# Altium schematic sheet driver2.SchDoc: Oncilla motor control board
size A4; DocumentNumber: 2; Revision: 3; SheetNumber: 2; SheetTotal: 5
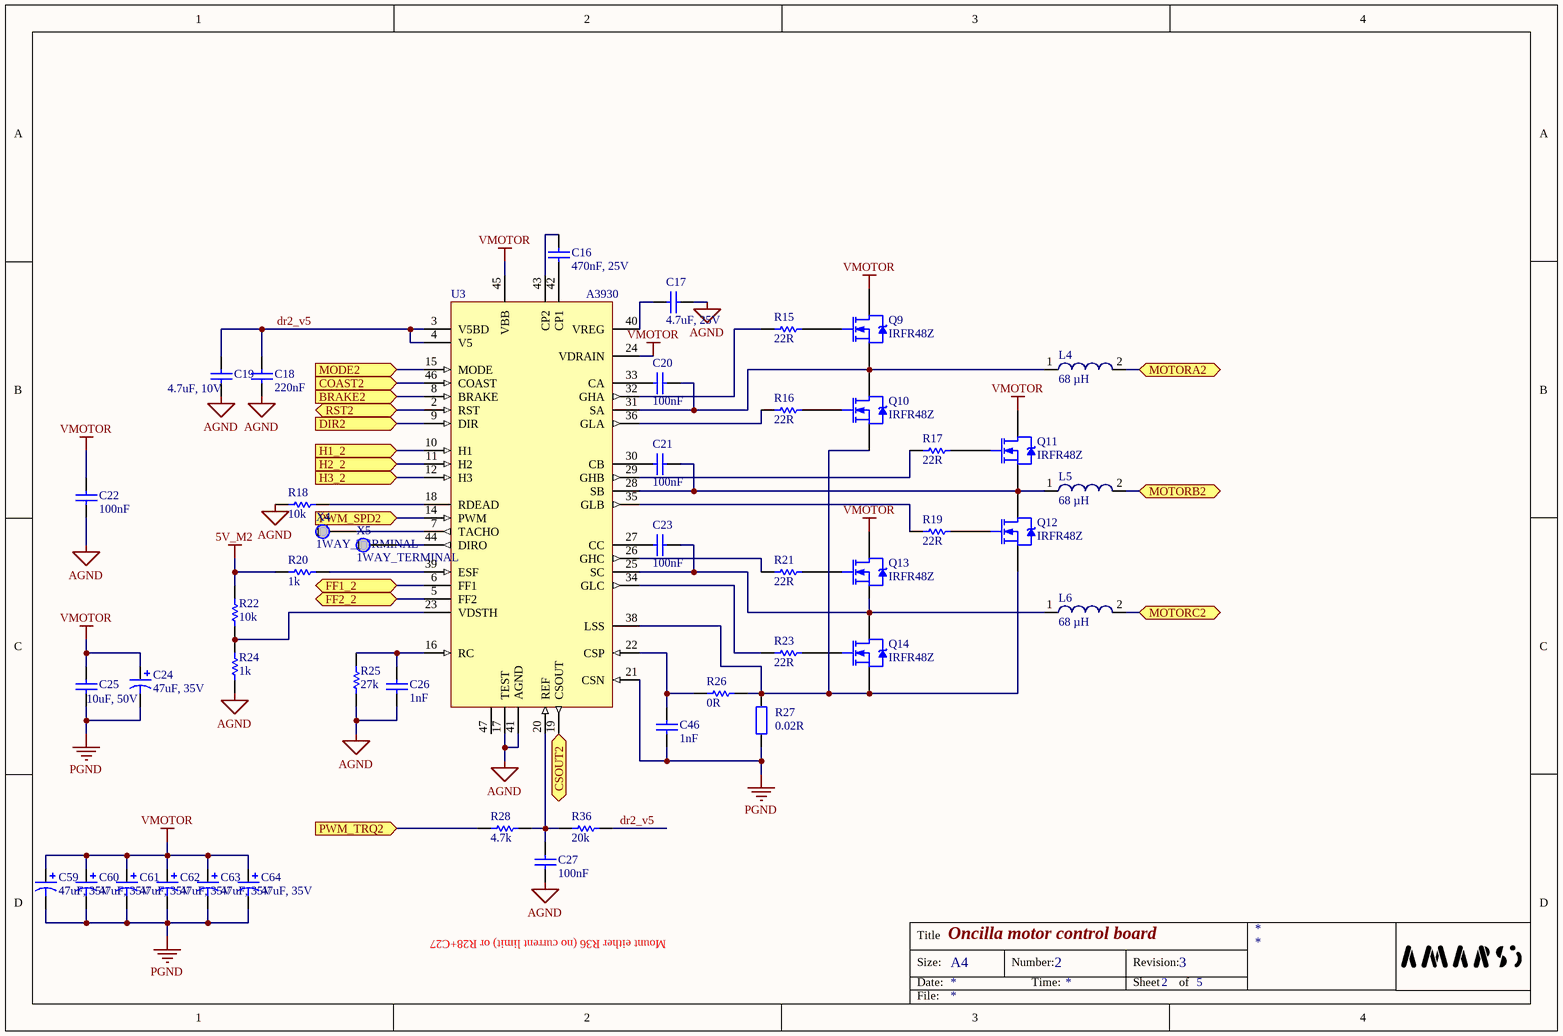
[diagram p0: driver2.SchDoc]

## Parts
C16  470nF, 25V  [CAPC1608L]
C17  4.7uF, 25V  [CAPC2512L]
C18  value 220nF  [CAPC1608L]  (hidden comment: 100nF)
C19  4.7uF, 10V  [CAPC1608L]
C20  100nF  [CAPC1608L]
C21  100nF  [CAPC1608L]
C22  100nF  [CAPC1608L]
C23  100nF  [CAPC1608L]
C24  47uF, 35V  [7343]
C25  10uF, 50V  [CAPC3216L]
C26  1nF  [CAPC1608L]
C27  100nF  [CAPC1608L]
C46  1nF  [CAPC1608L]
C59  47uF, 35V  [7343]
C60  47uF, 35V  [7343]
C61  47uF, 35V  [7343]
C62  47uF, 35V  [7343]
C63  47uF, 35V  [7343]
C64  47uF, 35V  [7343]
L4  68 µH  [IHLP-6767GZ-11]
L5  68 µH  [IHLP-6767GZ-11]
L6  68 µH  [IHLP-6767GZ-11]
Q9  IRFR48Z  [TO-252AA_N]
Q10  IRFR48Z  [TO-252AA_N]
Q11  IRFR48Z  [TO-252AA_N]
Q12  IRFR48Z  [TO-252AA_N]
Q13  IRFR48Z  [TO-252AA_N]
Q14  IRFR48Z  [TO-252AA_N]
R15  22R  [RESC1608L]
R16  22R  [RESC1608L]
R17  22R  [RESC1608L]
R18  10k  [RESC1608L]
R19  22R  [RESC1608L]
R20  1k  [RESC1608L]
R21  22R  [RESC1608L]
R22  10k  [RESC1608L]
R23  22R  [RESC1608L]
R24  1k  [RESC1608L]
R25  27k  [RESC1608L]
R26  0R  [RESC1608L]
R27  value 0.02R  [RESC6332N]  (hidden comment: 20mR)
R28  4.7k  [RESC1608L]
R36  20k  [RESC1608L]
U3  A3930  [TSQFP50P900X900X160_HS-48N]
X4  1WAY_TERMINAL  [TESTPIN 0.5mm]
X5  1WAY_TERMINAL  [TESTPIN 0.5mm]

## Ports
BRAKE2 (in), COAST2 (in), CSOUT2, DIR2 (in), FF1_2, FF2_2, H1_2 (in), H2_2 (in), H3_2 (in), MODE2 (in), MOTORA2, MOTORB2, MOTORC2, PWM_SPD2 (in), PWM_TRQ2 (in), RST2

## Nets
5V_M2: R20.1 R22.2
AGND: C17.2 C18.1 C19.1 C22.1 C26.1 C27.1 R18.1 R24.1 R25.1 U3.17(TEST) U3.41(AGND) U3.49(AGND)
PGND: C24.2 C25.1 C46.1 C59.2 C60.2 C61.2 C62.2 C63.2 C64.2 R27.1 U3.21(CSN)
VMOTOR: C22.2 C24.1 C25.2 C59.1 C60.1 C61.1 C62.1 C63.1 C64.1 Q9.4(D) Q11.4(D) Q13.4(D) U3.24(VDRAIN) U3.45(VBB)
BRAKE2: U3.8(BRAKE) ; port BRAKE2
COAST2: U3.46(COAST) ; port COAST2
CSOUT2: U3.19(CSOUT) ; port CSOUT2
DIR2: U3.9(DIR) ; port DIR2
dr2_v5: C18.2 C19.2 R36.2 U3.3(V5BD) U3.4(V5)
FF1_2: U3.6(FF1) ; port FF1_2
FF2_2: U3.5(FF2) ; port FF2_2
H1_2: U3.10(H1) ; port H1_2
H2_2: U3.11(H2) ; port H2_2
H3_2: U3.12(H3) ; port H3_2
MODE2: U3.15(MODE) ; port MODE2
MOTORA2: L4.2 ; port MOTORA2
MOTORB2: L5.2 ; port MOTORB2
MOTORC2: L6.2 ; port MOTORC2
PWM_SPD2: U3.14(PWM) ; port PWM_SPD2
PWM_TRQ2: R28.1 ; port PWM_TRQ2
RST2: U3.2(RST) ; port RST2
NetC16_1: C16.1 U3.42(CP1)
NetC16_2: C16.2 U3.43(CP2)
NetC17_1: C17.1 U3.40(VREG)
NetC20_1: C20.1 U3.33(CA)
NetC20_2: C20.2 L4.1 Q9.3(S) Q10.4(D) U3.31(SA)
NetC21_1: C21.1 U3.30(CB)
NetC21_2: C21.2 L5.1 Q11.3(S) Q12.4(D) U3.28(SB)
NetC23_1: C23.1 U3.27(CC)
NetC23_2: C23.2 L6.1 Q13.3(S) Q14.4(D) U3.25(SC)
NetC26_2: C26.2 R25.2 U3.16(RC)
NetC27_2: C27.2 R28.2 R36.1 U3.20(REF)
NetC46_2: C46.2 R26.1 U3.22(CSP)
NetQ9_1: Q9.1(G) R15.2
NetQ10_1: Q10.1(G) R16.2
NetQ10_3: Q10.3(S) Q12.3(S) Q14.3(S) R26.2 R27.2 U3.38(LSS)
NetQ11_1: Q11.1(G) R17.2
NetQ12_1: Q12.1(G) R19.2
NetQ13_1: Q13.1(G) R21.2
NetQ14_1: Q14.1(G) R23.2
NetR15_1: R15.1 U3.32(GHA)
NetR16_1: R16.1 U3.36(GLA)
NetR17_1: R17.1 U3.29(GHB)
NetR18_2: R18.2 U3.18(RDEAD)
NetR19_1: R19.1 U3.35(GLB)
NetR20_2: R20.2 U3.39(ESF)
NetR21_1: R21.1 U3.26(GHC)
NetR22_1: R22.1 R24.2 U3.23(VDSTH)
NetR23_1: R23.1 U3.34(GLC)
NetU3_7: U3.7(TACHO) X4.1
NetU3_44: U3.44(DIRO) X5.1

Not connected (* = marked no-connect by the designer): U3 47

## Notes on the sheet
- Mount either R36 (no current limit) or R28+C27
- Title
- Size:
- Date:
- A4
- Number:
- Time:
- Revision:
- Sheet
- of
- File:

## Library data of the parts
C16-C23 C25-C27 C46 = Cap Semi: Capacitor (Semiconductor SIM Model); Published: 8-Jun-2000; LatestRevisionDate: 29-May-2009; LatestRevisionNote: IPC-7351 Footprint Added.; PackageReference: C1206; Publisher: Altium Limited; PackageDescription: Chip Capacitor
  C16: Value: 470nF, 25V
  C17: Value: 4.7uF, 25V
  C19: Value: 4.7uF, 10V
  C20-C23 C27: Value: 100nF
  C25: Value: 10uF; Voltage: 50V
  C26 C46: Value: 1nF
C24 C59-C64 = 255D157X06R3D2T045: Note: See Data Sheet for full range of components; Published: 19-Mar-2004; DatasheetDocument: 04-Feb-2003; PackageReference: 7343; Publisher: Altium Limited; Code_JEITA: 7343; ComponentLink1Description: Manufacturer Link; ComponentLink1URL: http://www.vishay.com/; ComponentLink2Description: Datasheet; ComponentLink2URL: http://www.vishay.com/docs/40052/255d.pdf; Value: 47uF, 35V
L4-L6 = IHLP-6767GZ-11: IHLP-6767GZ-11 Low Profile, High Current Inductors
Q9-Q14 = IRFR110: HEXFET Power MOSFET; Note: Pin 2 is trimmed and is electrically connected to Drain.; Published: 8-Jun-2000; LatestRevisionDate: 20-Nov-2009; LatestRevisionNote: IPC-7351 Footprint Added.; DatasheetVersion: PD-9.524D; PackageReference: TO-252AA; Publisher: Altium Limited; PackageDescription: 3-Pin HEXFET Package 2.28 mm Pitch, 9.9 mm Lead Span; ComponentLink1Description: Manufacturer Link; ComponentLink1URL: http://www.irf.com/; ComponentLink2Description: Datasheet; ComponentLink2URL: http://www.irf.com/product-info/datasheets/data/irfr110.pdf; PackageVersion: Feb-2003; Code_JEDEC: TO-252-AA
R15-R26 R28 R36 = Res Semi: Semiconductor Resistor; Published: 8-Jun-2000; LatestRevisionDate: 17-Jul-2002; LatestRevisionNote: Re-released for DXP Platform.; PackageReference: AXIAL-0.5; Publisher: Altium Limited
  R15-R17 R19 R21 R23: Value: 22R
  R18 R22: Value: 10k
  R20 R24: Value: 1k
  R25: Value: 27k
  R26: Value: 0R
  R28: Value: 4.7k
  R36: Value: 20k
R27 = Res2: Resistor; Published: 8-Jun-2000; LatestRevisionDate: 17-Jul-2002; LatestRevisionNote: Re-released for DXP Platform.; PackageReference: AXIAL-0.4; Publisher: Altium Limited
U3 = A3930: brushless motor driver, 3-phase